# EAGLE design PIC_Trainer_16F (EAGLE 9.4.2)
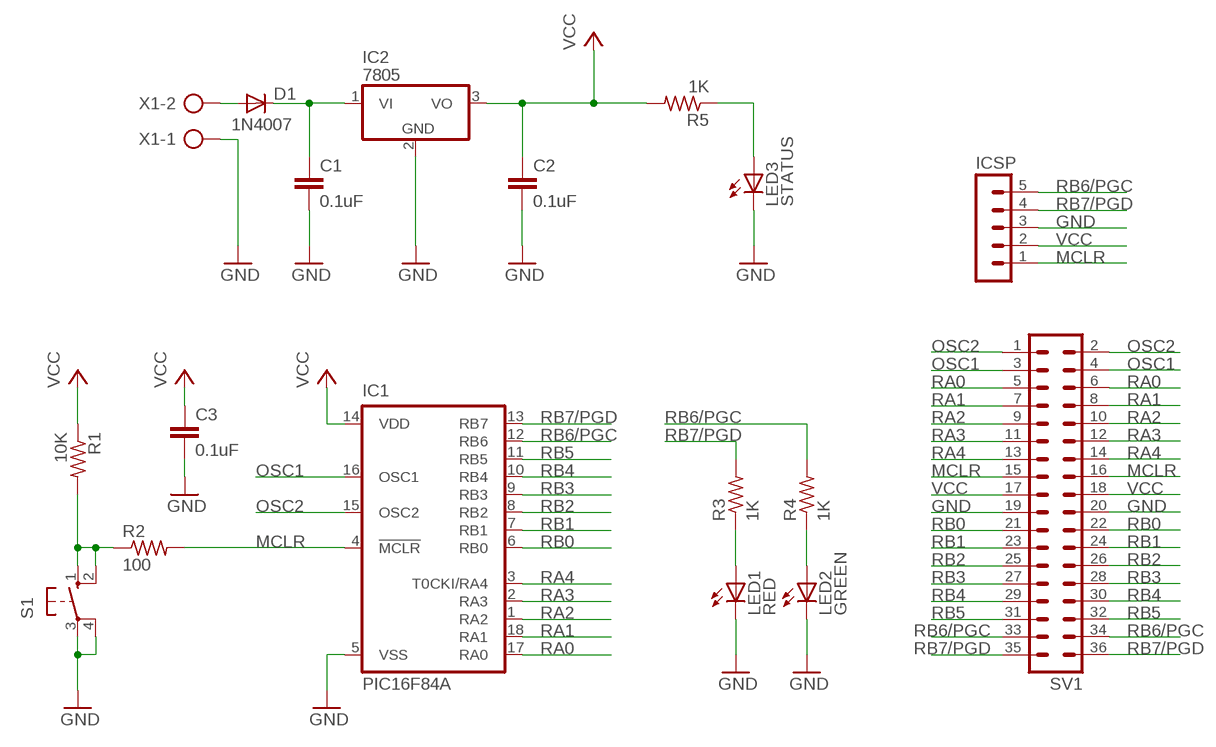
[diagram p0: schematic, sheet 1]

## Parts
C1  0.1uF  C-EU050-025X075  [C050-025X075]
C2  0.1uF  C-EU050-025X075  [C050-025X075]
C3  0.1uF  C-EU050-025X075  [C050-025X075]
D1  1N4007  1N4004  [DO41-10]
IC1  PIC16F84A  PIC16F84AP  [DIL18]
IC2  7805  7805T  [TO220H]
ICSP  MA05-1  [MA05-1]
LED1  RED  LED5MM  [LED5MM]
LED2  GREEN  LED5MM  [LED5MM]
LED3  STATUS  LED5MM  [LED5MM]
R1  10K  R-US_0207/7  [0207/7]
R2  100  R-US_0207/7  [0207/7]
R3  1K  R-US_0207/7  [0207/7]
R4  1K  R-US_0207/7  [0207/7]
R5  1K  R-US_0207/7  [0207/7]
S1  10-XX  [B3F-10XX]
SV1  MA18-2  [MA18-2]
X1  AK500/2-H  [AK500/2-H]

## Nets
GND: C1.2 C2.2 C3.2 IC1.5(VSS) IC2.2(GND) ICSP.3 LED1.K(C) LED2.K(C) LED3.K(C) S1.3(P) S1.4(P1) SV1.19 SV1.20 X1.1
MCLR: IC1.4(!MCLR) ICSP.1 R2.2 SV1.15 SV1.16
N$1: LED3.A R5.1
N$2: C1.1 D1.C IC2.1(VI)
N$3: D1.A X1.2
N$14: LED1.A R3.1
N$17: R1.2 R2.1 S1.1(S) S1.2(S1)
N$18: LED2.A R4.1
OSC1: IC1.16(OSC1) SV1.3 SV1.4
OSC2: IC1.15(OSC2) SV1.1 SV1.2
RA0: IC1.17(RA0) SV1.5 SV1.6
RA1: IC1.18(RA1) SV1.7 SV1.8
RA2: IC1.1(RA2) SV1.9 SV1.10
RA3: IC1.2(RA3) SV1.11 SV1.12
RA4: IC1.3(T0CKI/RA4) SV1.13 SV1.14
RB0: IC1.6(RB0) SV1.21 SV1.22
RB1: IC1.7(RB1) SV1.23 SV1.24
RB2: IC1.8(RB2) SV1.25 SV1.26
RB3: IC1.9(RB3) SV1.27 SV1.28
RB4: IC1.10(RB4) SV1.29 SV1.30
RB5: IC1.11(RB5) SV1.31 SV1.32
RB6/PGC: IC1.12(RB6) ICSP.5 R4.2 SV1.33 SV1.34
RB7/PGD: IC1.13(RB7) ICSP.4 R3.2 SV1.35 SV1.36
VCC: C2.1 C3.1 IC1.14(VDD) IC2.3(VO) ICSP.2 R1.1 R5.2 SV1.17 SV1.18

## Library data of the parts
C1-C3 = rcl:C-EU: CAPACITOR, European symbol
D1 = diode:1N4004: DIODE general purpose rectifier, 1 A
IC1 = microchip:PIC16F8*: MICROCONTROLLER 8-Bit PIC16F8X Family - CMOS Flash/EEPROM Pin Compatible : PIC16F83, PIC16CR83, PIC16F84A, PIC16CR84 see also PIC16C* <DEVICE:PIC16C*>; MF: MICROCHIP; MPN: PIC16F84A-04I/P; OC_FARNELL: 9760865; OC_NEWARK: 69K7635
IC2 = linear:78*: Positive VOLTAGE REGULATOR Source: http://cache.national.com/ds/LM/LM78L05.pdf http://www.fairchildsemi.com/ds/LM/LM7805.pdf
ICSP = con-lstb:MA05-1: PIN HEADER; OC_FARNELL: unknown; OC_NEWARK: unknown
LED1-LED3 = led:LED: LED OSRAM: - CHIPLED LG R971, LG N971, LY N971, LG Q971, LY Q971, LO R971, LY R971 LH N974, LH R974 LS Q976, LO Q976, LY Q976 LO Q996 - Hyper CHIPLED LW Q18S LB Q993, LB Q99A, LB R99A - SideLED LS A670, LO A670, LY A670, LG A670, LP A670 LB A673, LV A673, LT A673, LW A673 LH A674 LY A675 LS A676, LA A676, LO A676, LY A676, LW A676 LS A679, LY A679, LG A679 - Hyper Micro SIDELED® LS Y876, LA Y876, LO Y876, LY Y876 LT Y87S - SmartLED LW L88C, LW L88S LB L89C, LB L89S, LG L890 LS L89K, LO L89K, LY L89K LS L896, LA L896, LO L896, LY L896 - TOPLED LS T670, LO T670, LY T670, LG T670, LP T670 LSG T670, LSP T670, LSY T670, LOP T670, LYG T670 LG T671, LOG T671, LSG T671 LB T673, LV T673, LT T673, LW T673 LH T674 LS T676, LA T676, LO T676, LY T676, LB T676, LH T676, LSB T676, LW T676 LB T67C, LV T67C, LT T67C, LS T67K, LO T67K, LY T67K, LW E67C LS E67B, LA E67B, LO E67B, LY E67B, LB E67C, LV E67C, LT E67C LW T67C LS T679, LY T679, LG T679 LS T770, LO T770, LY T770, LG T770, LP T770 LB T773, LV T773, LT T773, LW T773 LH T774 LS E675, LA E675, LY E675, LS T675 LS T776, LA T776, LO T776, LY T776, LB T776 LHGB T686 LT T68C, LB T68C - Hyper Mini TOPLED® LB M676 - Mini TOPLED Santana® LG M470 LS M47K, LO M47K, LY M47K Source: http://www.osram.convergy.de LUXEON: - LUMILED® LXK2-PW12-R00, LXK2-PW12-S00, LXK2-PW14-U00, LXK2-PW14-V00 LXK2-PM12-R00, LXK2-PM12-S00, LXK2-PM14-U00 LXK2-PE12-Q00, LXK2-PE12-R00, LXK2-PE12-S00, LXK2-PE14-T00, LXK2-PE14-U00 LXK2-PB12-K00, LXK2-PB12-L00, LXK2-PB12-M00, LXK2-PB14-N00, LXK2-PB14-P00, LXK2-PB14-Q00 LXK2-PR12-L00, LXK2-PR12-M00, LXK2-PR14-Q00, LXK2-PR14-R00 LXK2-PD12-Q00, LXK2-PD12-R00, LXK2-PD12-S00 LXK2-PH12-R00, LXK2-PH12-S00 LXK2-PL12-P00, LXK2-PL12-Q00, LXK2-PL12-R00 Source: www.luxeon.com KINGBRIGHT: KA-3528ASYC Source: www.kingbright.com
R1-R5 = rcl:R-US_: RESISTOR, American symbol
S1 = switch-omron:10-XX: OMRON SWITCH; MPN: B3F-1000; OC_FARNELL: 176432; OC_NEWARK: 36M3542
SV1 = con-lstb:MA18-2: PIN HEADER; OC_FARNELL: unknown; OC_NEWARK: unknown
X1 = con-ptr500:AK500/2-H: CONNECTOR Aug. 2004 / PTR Meßtechnik: Die Bezeichnung der Serie AK505 wurde geändert. Es handelt sich hierbei um AK500 in horizontaler Ausführung.; OC_FARNELL: unknown; OC_NEWARK: unknown

## Board
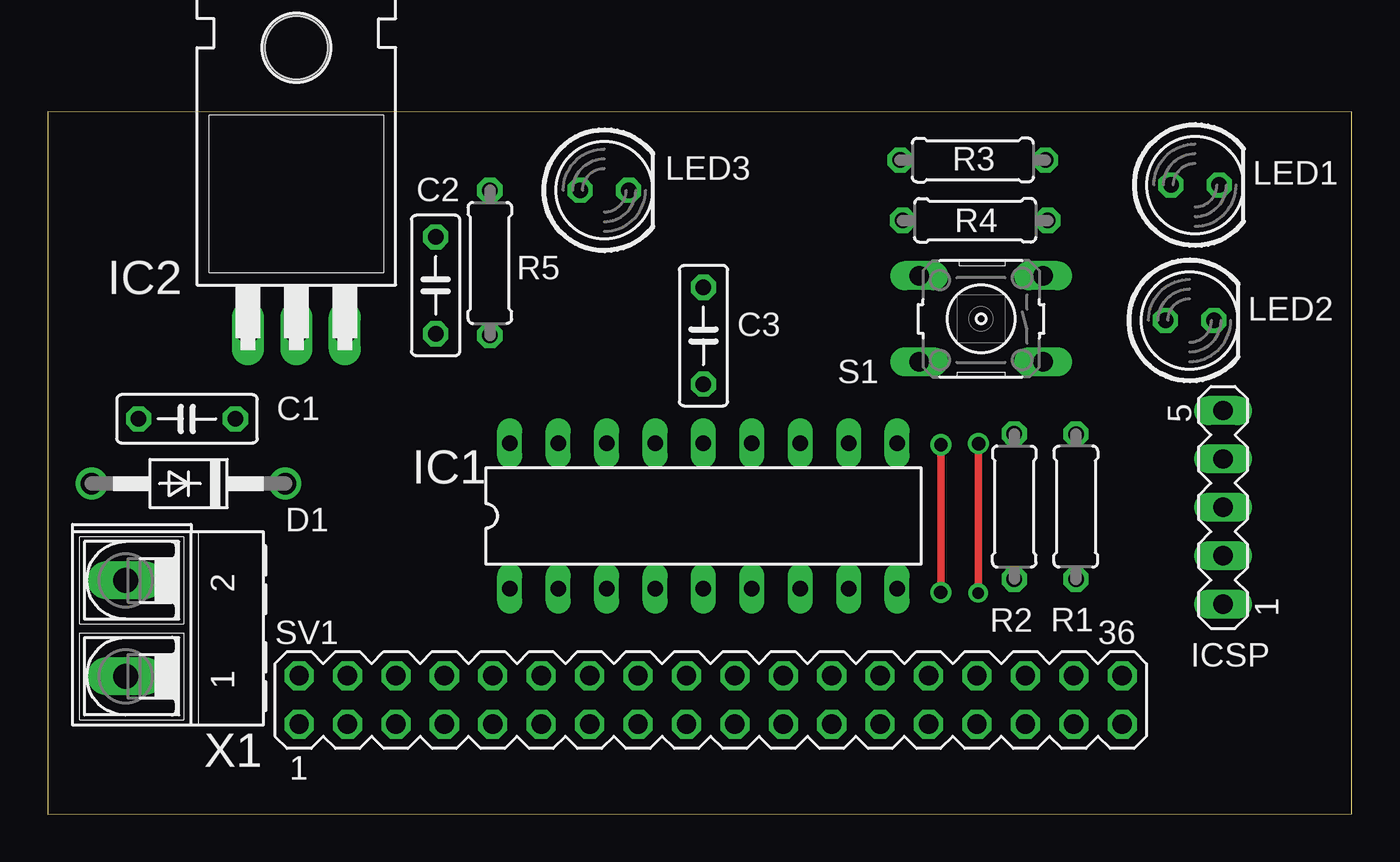
[diagram p1: board, top side]
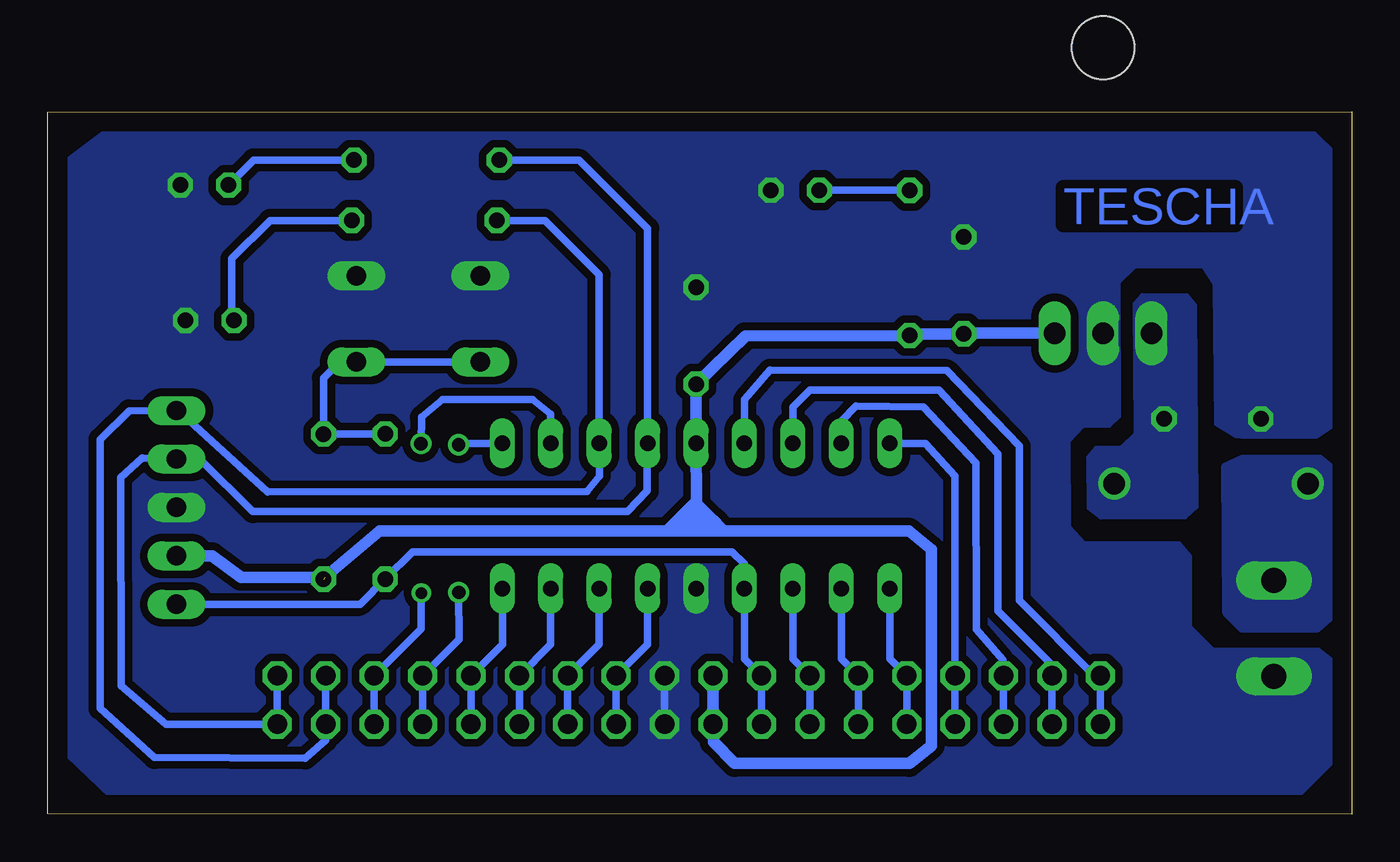
[diagram p2: board, bottom side, seen from below]

Size 68.42 x 36.84 mm. Coordinates in mm from the lower left corner, seen from the top.
Outline: 0,0 68.41,0.02 68.42,36.82 0.01,36.84 0,0
Copper layers (1*16): Top 0.035mm / dielectric 1.5mm / Bottom 0.035mm
Design rules "default": minimum track width 10mil, minimum drill 24mil, track to track 8mil, track to pad 8mil, pad to pad 8mil, via to via 8mil, smd to smd 8mil, copper to edge 40mil, drill to drill 8mil, minimum pad ring 10mil, minimum via ring 8mil, stop-mask expansion 4mil, vias tented up to drill 0mil, thermal gap 10mil

### Footprints (pad centres in the part's own frame; a part is rotated, then mirrored left to right if it is on the bottom)
C050-025X075 = drill 0.813 octagon: 1 -2.54,0; 2 2.54,0
DO41-10 = drill 1.118: A 5.08,0; C -5.08,0
DIL18 = drill 0.813 long: 1 -10.16,-3.81; 2 -7.62,-3.81; 3 -5.08,-3.81; 4 -2.54,-3.81; 5 0,-3.81; 6 2.54,-3.81; 7 5.08,-3.81; 8 7.62,-3.81; 9 10.16,-3.81; 10 10.16,3.81; 11 7.62,3.81; 12 5.08,3.81; 13 2.54,3.81; 14 0,3.81; 15 -2.54,3.81; 16 -5.08,3.81; 17 -7.62,3.81; 18 -10.16,3.81
TO220H = drill 1.118 long: 1 -2.54,-10.16; 2 0,-10.16; 3 2.54,-10.16 | hole 3.302: 0,4.826
MA05-1 = drill 1.016 long: 1 -5.08,0; 2 -2.54,0; 3 0,0; 4 2.54,0; 5 5.08,0
LED5MM = drill 0.813 octagon: A -1.27,0; K 1.27,0
0207/7 = drill 0.813 octagon: 1 -3.81,0; 2 3.81,0
B3F-10XX = drill 1.016 long: 1 -3.251,2.261; 2 3.251,2.261; 3 -3.251,-2.261; 4 3.251,-2.261
MA18-2 = drill 1.016 octagon: 1 -21.59,-1.27; 2 -21.59,1.27; 3 -19.05,-1.27; 4 -19.05,1.27; 5 -16.51,-1.27; 6 -16.51,1.27; 7 -13.97,-1.27; 8 -13.97,1.27; 9 -11.43,-1.27; 10 -11.43,1.27; 11 -8.89,-1.27; 12 -8.89,1.27; 13 -6.35,-1.27; 14 -6.35,1.27; 15 -3.81,-1.27; 16 -3.81,1.27; 17 -1.27,-1.27; 18 -1.27,1.27; 19 1.27,-1.27; 20 1.27,1.27; 21 3.81,-1.27; 22 3.81,1.27; 23 6.35,-1.27; 24 6.35,1.27; 25 8.89,-1.27; 26 8.89,1.27; 27 11.43,-1.27; 28 11.43,1.27; 29 13.97,-1.27; 30 13.97,1.27; 31 16.51,-1.27; 32 16.51,1.27; 33 19.05,-1.27; 34 19.05,1.27; 35 21.59,-1.27; 36 21.59,1.27
AK500/2-H = drill 1.321 long: 1 -2.515,0; 2 2.515,0

### Placement (x,y rotation side)
C1  7.31,20.74 180 top
C2  20.35,27.74 90 top
C3  34.4,25.1 90 top
D1  7.39,17.34 180 top
IC1  34.4,15.65 0 top
IC2  13.05,35.39 0 top
ICSP  61.66,16.09 90 top
LED1  60.19,33 0 top
LED2  59.91,25.9 0 top
LED3  29.21,32.74 0 top
R1  53.94,16.13 90 top
R2  50.71,16.14 270 top
R3  48.53,34.31 180 top
R4  48.66,31.15 180 top
R5  23.2,28.92 270 top
S1  48.97,25.98 180 top
SV1  34.78,5.99 0 top
X1  4.09,9.75 90 top

### Tracks (layer width: path | path; a pad name or v marks a point on that pad's centre or on a via)
GND
  Bottom 0.406: SV1.19 SV1.20
  pour Bottom (isolate 0.406, no thermals): 5.81,19.76 1.84,19.76 0.74,20.49 0.67,34.51 2.01,35.86 65.01,36.18 67.42,34.36 67.41,3.04 65.13,0.86 2.73,0.93 0.81,2.84 0.76,7.9 1.74,8.66 7.24,8.66 8.44,9.86 8.44,13.54 9.04,14.25 14,14.25 14.79,15.12 14.82,19.53 14.08,20.31 12.69,20.34 12.17,20.82 12.19,27.87 11.36,28.67 7.82,28.69 7.24,27.82 7.15,20.44 6.09,19.79
MCLR
  Bottom 0.406: SV1.15 SV1.16 31.86,8.15 IC1.4 31.86,11.86 31.86,13.13 32.52,13.76 49.09,13.77 49.27,13.77 R2.2 52.03,11 62.56,11 ICSP.1
N$1
  Bottom 0.406: R5.1 LED3.A
N$2
  pour Bottom (no thermals): 8.18,26.72 8.11,16.08 8.7,15.54 13.18,15.52 13.85,16.03 13.87,18.73 13.42,19.25 12.11,19.29 11.38,19.99 11.42,26.81 11.03,27.28 8.63,27.26
N$3
  pour Bottom (no thermals): 2.48,9.67 5.78,9.67 6.63,10.54 6.69,18.27 5.72,18.72 1.71,18.73 0.97,18.14 0.92,10.44 1.81,9.67
N$4
  Bottom 0.61: 34.32,16.24 34.32,16.23 33.22,15.13 34.82,15.13 34.98,15.3 34.68,15.3 34.31,15.66 34.31,15.79 34.35,15.82
N$5
  Bottom 0.61: 34.13,15.55 34.05,15.55 33.92,15.42 33.51,15.42 33.06,14.97
N$14
  Bottom 0.406: R3.1 57.61,34.31 LED1.A
N$17
  Bottom 0.406: S1.2 S1.1 53.11,23.72 53.94,22.89 R1.2 R2.1
N$18
  Bottom 0.406: R4.1 56.75,31.15 58.76,29.14 58.76,26.02 LED2.A
OSC1
  Bottom 0.406: SV1.3 SV1.4 15.73,7.82 18.57,10.66 18.57,18.9 21.66,22.24 28.43,22.24 29.33,21.35 IC1.16
OSC2
  Bottom 0.406: SV1.1 SV1.2 13.5,7.26 17.45,11.2 17.45,19.3 21.25,23.26 30.53,23.3 31.86,21.75 IC1.15
RA0
  Bottom 0.406: SV1.5 SV1.6 18.31,8.09 19.69,9.69 19.71,18.43 22.49,21.36 26.01,21.4 26.77,20.63 IC1.17
RA1
  Bottom 0.406: SV1.7 SV1.8 20.81,17.75 22.38,19.45 IC1.18
RA2
  Bottom 0.406: SV1.9 SV1.10 24.24,8.15 IC1.1
RA3
  Bottom 0.406: SV1.11 SV1.12 26.78,8.15 IC1.2
RA4
  Bottom 0.406: SV1.13 SV1.14 29.32,8.15 IC1.3
RB0
  Bottom 0.406: IC1.6 36.94,8.91 SV1.22 SV1.21
RB1
  Bottom 0.406: IC1.7 39.48,8.91 SV1.24 SV1.23
RB2
  Bottom 0.406: IC1.8 42.02,8.91 SV1.26 SV1.25
RB3
  Bottom 0.406: IC1.9 44.56,8.91 SV1.28 SV1.27
RB4  (via drill 0.7)
  Top 0.406: v46.86,19.38 46.86,11.87 v46.85,11.63
  Bottom 0.406: SV1.29 SV1.30 46.84,9.17 v46.85,11.63 | IC1.10 46.79,19.46 v46.86,19.38
RB5  (via drill 0.6, 0.7)
  Top 0.406: v48.83,19.44 48.82,11.61 v48.82,11.6
  Bottom 0.406: SV1.31 SV1.32 48.82,9.72 v48.82,11.6 | IC1.11 42.02,20.98 42.98,21.75 47.7,21.75 48.8,20.83 48.82,19.46 v48.83,19.44
RB6/PGC
  Bottom 0.406: IC1.12 | IC1.12 39.47,17.74 40.12,16.93 56.88,16.91 61.57,21.18 ICSP.5 62.8,21.17 64.15,21.16 65.66,19.66 65.66,5.54 62.82,2.97 54.91,2.94 53.83,3.86 SV1.33 SV1.34 | IC1.12 39.48,28.3 42.33,31.15 R4.2
RB7/PGD
  Bottom 0.406: R3.2 40.53,34.31 36.94,30.72 IC1.13 36.97,16.95 37.99,15.88 57.66,15.87 60.43,18.6 62.79,18.62 ICSP.4 62.82,18.65 63.45,18.68 64.58,17.66 64.56,6.73 62.2,4.72 SV1.35 SV1.36
VCC  (1 unrouted)
  Bottom 0.61: SV1.18 SV1.17 33.5,4.71 33.5,3.78 32.38,2.66 23.22,2.66 22.06,3.59 22.07,13.89 23.24,14.85 35.92,14.85 | IC2.3 20.32,25.23 | C2.1 23.11,25.2 | R5.2 31.81,25.09 C3.1 34.4,22.5 IC1.14 34.39,16.4 35.92,14.85 | 35.92,14.85 50.99,14.86 53.88,12.43 58.28,12.43 59.8,13.55 ICSP.2
  Bottom 1.016: 20.32,25.23 C2.1 | 23.11,25.2 R5.2

### Text on the board
Bottom: TESCHA